# Altium schematic sheet Sheet2.SchDoc: Projet M1 Equipe 2
size A4; DrawnBy: Jordan Chevalier; DocumentNumber: 1; Revision: V1.0 Rev A; SheetNumber: 2; SheetTotal: 3
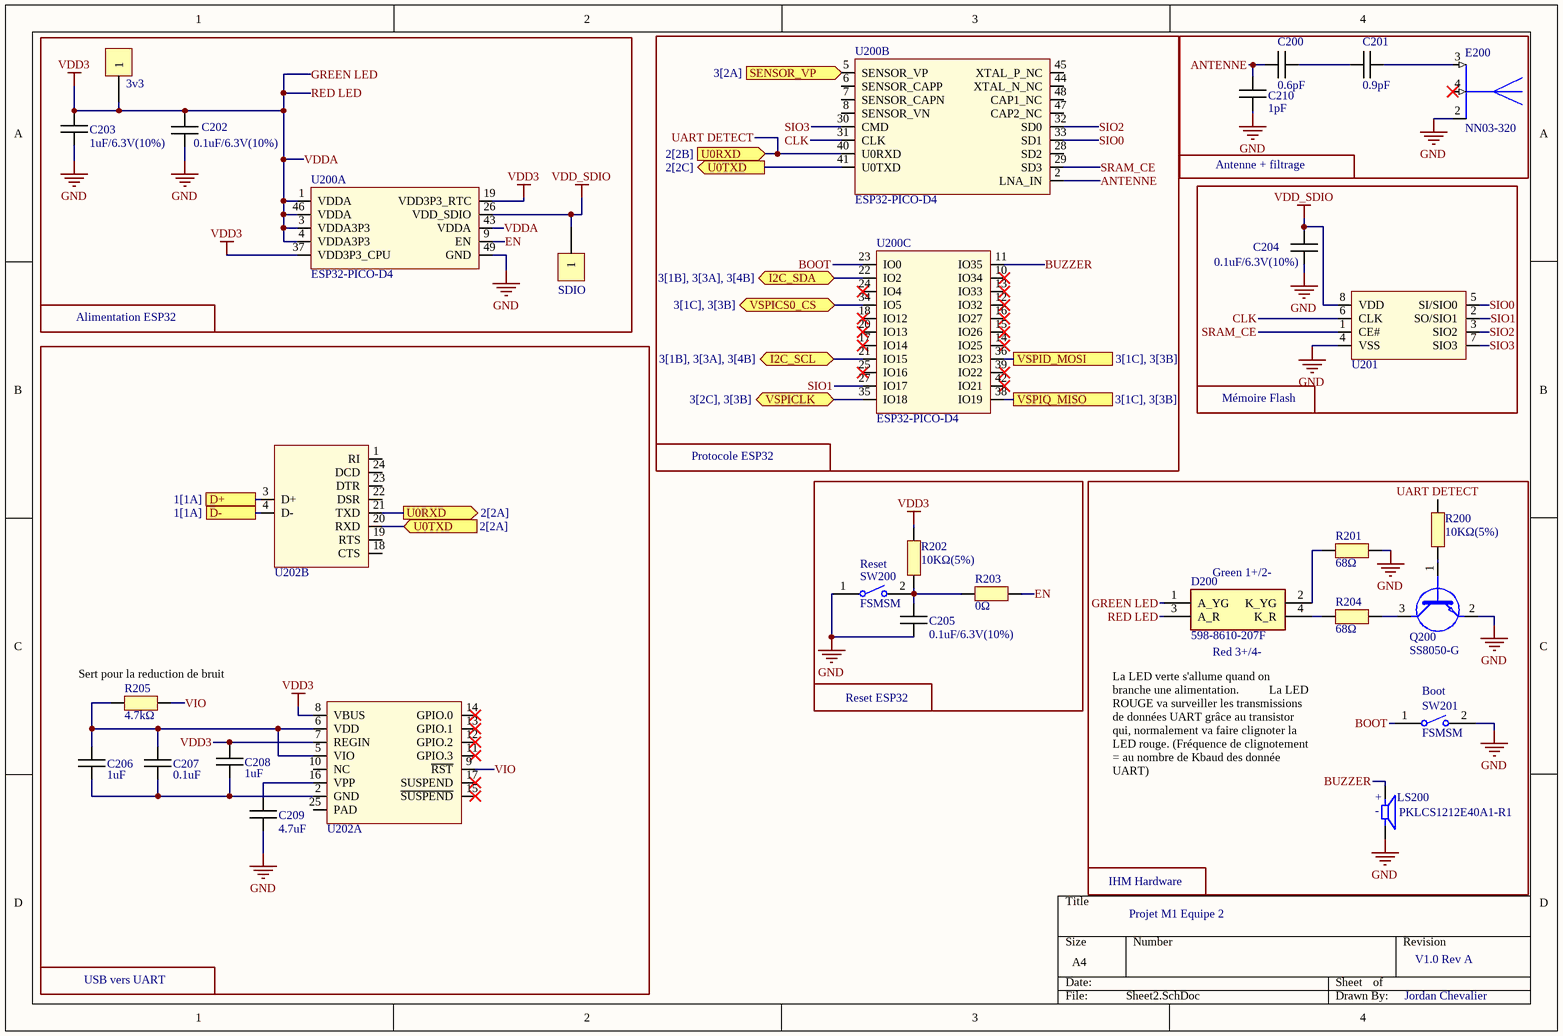
[diagram p0: Sheet2.SchDoc]

## Parts
3v3  Plage CMS 10x5  [Plage CMS 10x5]  (value not drawn)  (no BOM)
C200  0.6pF  [CAPC1005X06N]
C201  0.9pF  [CAPC1005X06N]
C202  0.1uF/6.3V(10%)  [CAPC1005X06N]
C203  1uF/6.3V(10%)  [CAPC1005X06N]
C204  0.1uF/6.3V(10%)  [CAPC1005X06N]
C205  0.1uF/6.3V(10%)  [CAPC1005X06N]
C206  1uF  [CAPC1005X06N]
C207  0.1uF  [CAPC1005X06N]
C208  1uF  [CAPC1005X06N]
C209  4.7uF  [CAPC1005X06N]
C210  1pF  [CAPC1005X06N]
D200  598-8610-207F  [5988610207F]
E200  NN03-320  [XCVR_NN03-320]
LS200  PKLCS1212E40A1-R1  [SPKR_PKLCS1212E40A1-R1]
Q200  SS8050-G  [SS8050-G]
R200  10KΩ(5%)  [RESC1005X06N]
R201  68Ω  [RESC1005X06N]
R202  10KΩ(5%)  [RESC1005X06N]
R203  0Ω  [RESC1005X06N]
R204  68Ω  [RESC1005X06N]
R205  4.7kΩ  [RESC1005X06N]
SDIO  Plage CMS 10x5  [Plage CMS 10x5]  (value not drawn)  (no BOM)
SW200  FSMSM  [TECO-FSMSM-2_V]
SW201  FSMSM  [TECO-FSMSM-2_V]
U200  ESP32-PICO-D4  [PQFN50P700X700X104_HS-49N]  (parts A,B,C of 3)
U201  IS66WVS1M8BLL-104NLI  [SOIC127P600X175-8N]  (value not drawn)
U202  CP2104-F03-GM  [PQFN50P400X400X80_HS-25N]  (value not drawn)  (parts A,B of 2)

## Blocks framed on the sheet
Alimentation ESP32: 3v3 C202 C203 SDIO U200
Protocole ESP32: U200
Antenne + filtrage: C200 C201 C210 E200
Mémoire Flash: C204 U201
USB vers UART: C206-C209 R205 U202

## Ports
D+ (see 1[1A]), D- (see 1[1A]), I2C_SCL (bidir, see 3[1B], 3[3A], 3[4B]), I2C_SDA (bidir, see 3[1B], 3[3A], 3[4B]), SENSOR_VP (in, see 3[2A]), U0RXD (in, see 2[2B]), U0RXD (out, see 2[2A]), U0TXD (in, see 2[2A]), U0TXD (out, see 2[2C]), VSPICLK (bidir, see 3[2C], 3[3B]), VSPICS0_CS (bidir, see 3[1C], 3[3B]), VSPID_MOSI (see 3[1C], 3[3B]), VSPIQ_MISO (see 3[1C], 3[3B])

## Nets
GND: C202.2 C203.2 C204.2 C205.2 C209.2 C210.2 E200.2(GROUND) LS200.N Q200.2(E) R201.2 SW200.1 SW201.2 U200.49(GND) U201.4(VSS)
GREEN LED: 3v3.1 C202.1 C203.1 C208.1 D200.1(A_YG) D200.3(A_R) R202.2 U200.1(VDDA) U200.3(VDDA3P3) U200.4(VDDA3P3) U200.19(VDD3P3_RTC) U200.37(VDD3P3_CPU) U200.43(VDDA) U200.46(VDDA) U202.7(REGIN) U202.8(VBUS)  [also labelled RED LED, VDD3, VDDA]
VDD_SDIO: C204.1 SDIO.1 U200.26(VDD_SDIO) U201.8(VDD)
ANTENNE: C200.1 C210.1 U200.2(LNA_IN)
BOOT: SW201.1 U200.23(IO0)
BUZZER: LS200.P U200.11(IO35)
CLK: U200.31(CLK) U201.6(CLK)
D+: U202.3(D+) ; port D+
D-: U202.4(D-) ; port D-
EN: R203.2 U200.9(EN)
I2C_SCL: U200.21(IO15) ; port I2C_SCL
I2C_SDA: U200.22(IO2) ; port I2C_SDA
SENSOR_VP: U200.5(SENSOR_VP) ; port SENSOR_VP
SIO0: U200.33(SD1) U201.5(SI/SIO0)
SIO1: U200.27(IO17) U201.2(SO/SIO1)
SIO2: U200.32(SD0) U201.3(SIO2)
SIO3: U200.30(CMD) U201.7(SIO3)
SRAM_CE: U200.29(SD3) U201.1(CE#)
U0TXD: U200.41(U0TXD) U202.20(RXD) ; port U0TXD
UART DETECT: R200.2 U200.40(U0RXD) U202.21(TXD) ; port U0RXD
VIO: R205.2 U202.9(~{RST})
VSPICLK: U200.35(IO18) ; port VSPICLK
VSPICS0_CS: U200.34(IO5) ; port VSPICS0_CS
VSPID_MOSI: U200.36(IO23) ; port VSPID_MOSI
VSPIQ_MISO: U200.38(IO19) ; port VSPIQ_MISO
NetC200_2: C200.2 C201.2
NetC201_1: C201.1 E200.3(FEED_BLUETOOTH)
NetC205_1: C205.1 R202.1 R203.1 SW200.2
NetC206_1: C206.1 C207.1 R205.1 U202.5(VIO) U202.6(VDD)
NetC206_2: C206.2 C207.2 C208.2 U202.2(GND)
NetC209_1: C209.1 U202.16(VPP)
NetD200_2: D200.2(K_YG) R201.1
NetD200_4: D200.4(K_R) R204.1
NetQ200_1: Q200.1(B) R200.1
NetQ200_3: Q200.3(C) R204.2

Not connected (* = marked no-connect by the designer): E200 4(FEED_GNSS)*; U200 6(SENSOR_CAPP) 7(SENSOR_CAPN) 8(SENSOR_VN) 10(IO34)* 12(IO32)* 13(IO33)* 14(IO25)* 15(IO26)* 16(IO27)* 17(IO14)* 18(IO12)* 20(IO13)* 24(IO4)* 25(IO16)* 28(SD2) 39(IO22)* 42(IO21)* 44(XTAL_N_NC) 45(XTAL_P_NC) 47(CAP2_NC) 48(CAP1_NC); U202 1(RI) 10(NC) 11(GPIO.3)* 12(GPIO.2)* 13(GPIO.1)* 14(GPIO.0)* 15(~{SUSPEND})* 17(SUSPEND)* 18(CTS) 19(RTS) 22(DSR) 23(DTR) 24(DCD) 25(PAD)

## Notes on the sheet
- Reset
- (near D200) Green 1+/2-
- (near D200) Red 3+/4-
- (near R205) Sert pour la reduction de bruit
- Reset ESP32
- (near SW201) Boot
- La LED verte s'allume quand on branche une alimentation.          La LED ROUGE va surveiller les transmissions de données UART grâce au transistor qui, normalement va faire clignoter la LED rouge. (Fréquence de clignotement = au nombre de Kbaud des donnée UART)
- IHM Hardware
- (in symbol PKLCS1212E40A1-R1) +; -

## Library data of the parts
3v3 SDIO = Plage CMS 10x5: Plage de report CMS 10x5mm; PN: L30; Value: Plage CMS 10x5; Footprint_statut: ok
C200-C210 = Capacitor
D200 = 598-8610-207F: Standard LEDs - SMD Red/Green WC 80/50mcd 645/570nm; Manufacturer_Name: Dialight; Geometry.Height: 0.8mm; Manufacturer_Part_Number: 598-8610-207F; Mouser Part Number: 645-598-8610-207F; Mouser Price/Stock: https://www.mouser.co.uk/ProductDetail/Dialight/598-8610-207F?qs=7JStj%2FjQ2SFuCjosqwklHQ%3D%3D; Arrow Part Number: 598-8610-207F; Arrow Price/Stock: https://www.arrow.com/en/products/598-8610-207f/dialight?region=nac; Datasheet Link: https://media.digikey.com/pdf/Data%20Sheets/Dialight%20PDFs/598%20Series%201210%20Pkg%20Bi-Color.pdf
E200 = NN03-320: Dual port antenna booster for GNSS, Bluetooth, 5G and UWB (1561 - 1606MHz, 2400 - 2500MHz, 3400 - 3800MHz, 3100 - 4800MHz and 6000 - 10600 MHz), signal booster; Manufacturer_Name: Ignion; Manufacturer_Part_Number: NN03-320; Mouser Part Number: 128-NN03-320
LS200 = PKLCS1212E40A1-R1: Buzzers Transducer, Externally Driven Piezo 1.5V 2kHz 70dB @ 1.5V, 10cm Surface Mount Solder Pads; MF: Murata Electronics; Value: *; MP: PKLCS1212E40A1-R1; Package: None; Availability: Unavailable; Price: None
Q200 = SS8050-G: Bipolar Transistors - BJT NPN TRANSISTOR 1.5A 40V
R200-R205 = Resistor
SW200 SW201 = CMP-2000-07511-1: FSMSM Push Button Switch, 50 mA, -35 to 85 degC, 2-Pin SMD, RoHS, Bulk; Manufacturer: TE Connectivity; Actuator Length: 1.07mm; Electrical Life: 20000Cycles; Actuator Material: Polyamide; Current Rating: 50mA; Illumination Type: Illuminated; Voltage Rating (DC): 24V; Contact Resistance: 100mOhm; Case\/Package: SMD/SMT; Operating Force: 180gf; Switch Travel: 0.25mm; Max Voltage Rating (DC): 12V; Throw Configuration: SPST; Packaging: LoosePiece; Max Operating Temperature: 85degC; ELV: Compliant; Package Description: 2-Pin Surface Mount Device, Body 6 x 3.5 mm, Pitch 9.19 mm; RoHSCompliant: true; Manufacturer URL: http://www.te.com/; Contact Plating: Silver; Contact Material: Brass; Mounting Technology: SurfaceMount; Contact Current Rating: 50mA; Datasheet Version: Rev. C2, 08/2014; Datasheet URL: http://www.te.com/commerce/DocumentDelivery/DDEController?Action=showdoc&DocId=Customer+Drawing%7F1437566-3%7FC2%7Fpdf%7FEnglish%7FENG_CD_1437566-3_C2_1437566_3_1_c.dwg.pdf%7F1437566-3; Mechanical Life: 20000Cycles; Package Reference: FSMSM; REACH SVHC: Unknown; Orientation: Straight; Min Operating Temperature: -35degC; Lead Free: LeadFree; Termination: GullWing; Package Quantity: 1000; Mount: SurfaceMount
U200 = ESP32: Système RF sur puce - SoC SIP module ESP32 with 4MByte Flash, Dual Core MCU, Wi-Fi & Bluetooth Combo, LGA48-pin, 7*7mm; Manufacturer 1: Espressif Systems; Supplier 1: Digi-Key; Supplier Part Number 1: 1904-1029-1-ND; Manufacturer Part Number 1: ESP32-PICO-D4
U201 = SRAM: SRAM 8Mb, SerialRAM, 2.7V-3.6V, 104MHz, 8 pin SOIC 150 mil, RoHS; Manufacturer 1: ISSI; Supplier 1: Digi-Key; Supplier Part Number 1: 706-IS66WVS1M8BLL-104NLI-ND; Manufactuer Part Number 1: IS66WVS1M8BLL-104NLI
U202 = USBBridge: USB Bridge, USB to UART USB 2.0 UART Interface 24-QFN (4x4); Manufacturer 1: Silicon Labs; Supplier 1: Arrow Electronics; Supplier Part Number 1: CP2104-F03-GM; Manufacturer Part Number 1: CP2104-F03-GM